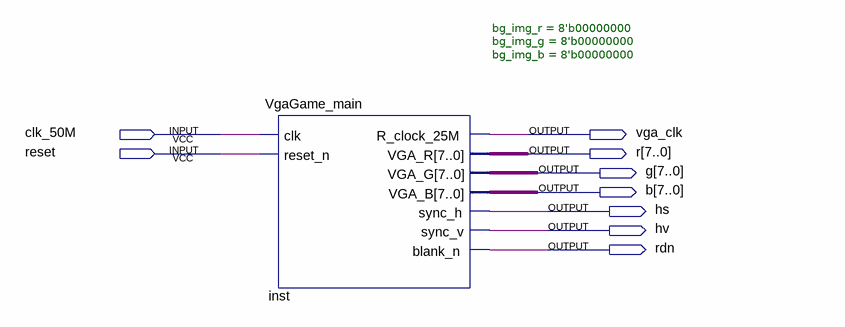
[diagram p0: schematic sheet]
// Quartus schematic VGAagain.bdf as structural Verilog: 1 symbols, 9 pins
module VGAagain (
  input  clk_50M,
  input  reset,
  output vga_clk,
  output [7:0] r,
  output [7:0] g,
  output [7:0] b,
  output hs,
  output hv,
  output rdn
);

  VgaGame_main #(.bg_img_r(8'b00000000), .bg_img_g(8'b00000000), .bg_img_b(8'b00000000)) inst (
    .clk(clk_50M), .reset_n(reset), .R_clock_25M(vga_clk), .VGA_R(r), .VGA_G(g), .VGA_B(b), .sync_h(hs),
    .sync_v(hv), .blank_n(rdn));
endmodule
